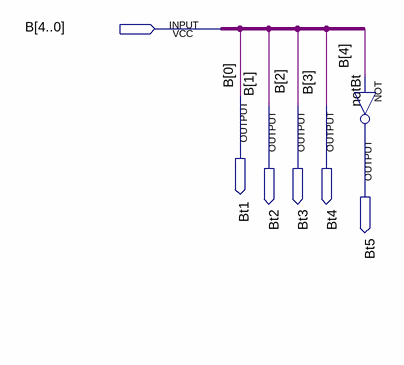
[diagram p0: schematic sheet]
// Quartus schematic subtrator_troca_sinal.bdf as structural Verilog: 1 symbols, 6 pins
module subtrator_troca_sinal (
  input  [4:0] B,
  output Bt1,
  output Bt2,
  output Bt3,
  output Bt4,
  output Bt5
);

  not notBt (Bt5, B[4]);

  assign Bt1 = B[0];
  assign Bt2 = B[1];
  assign Bt3 = B[2];
  assign Bt4 = B[3];
endmodule
